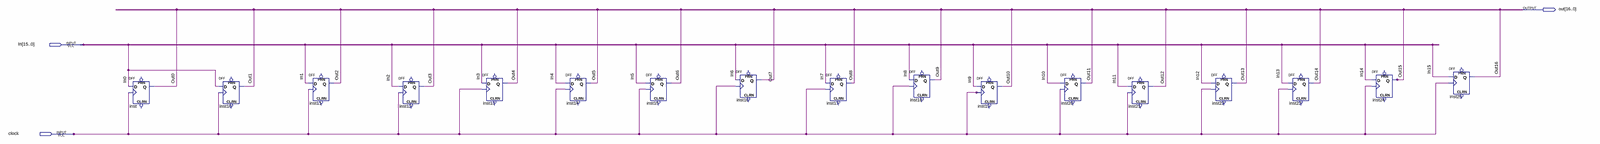
[diagram p0: schematic sheet, whole]
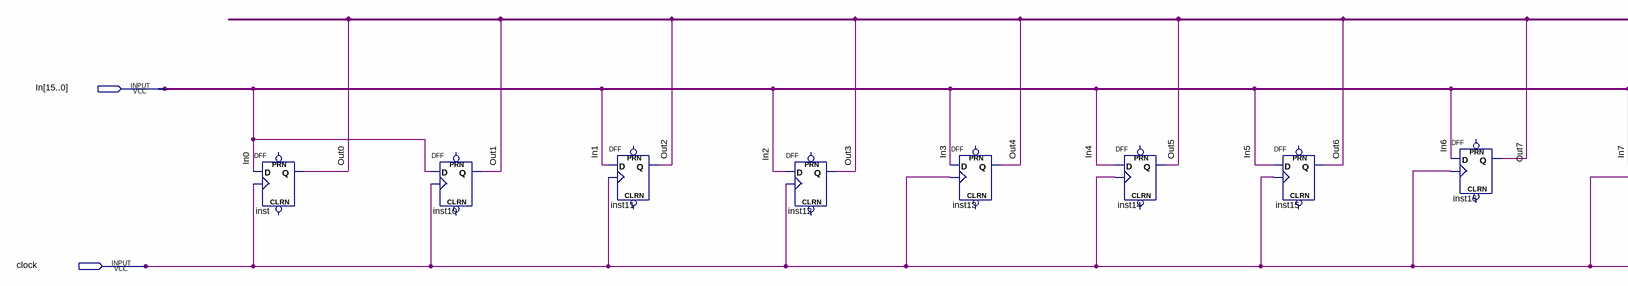
[diagram p1: schematic sheet, left part]
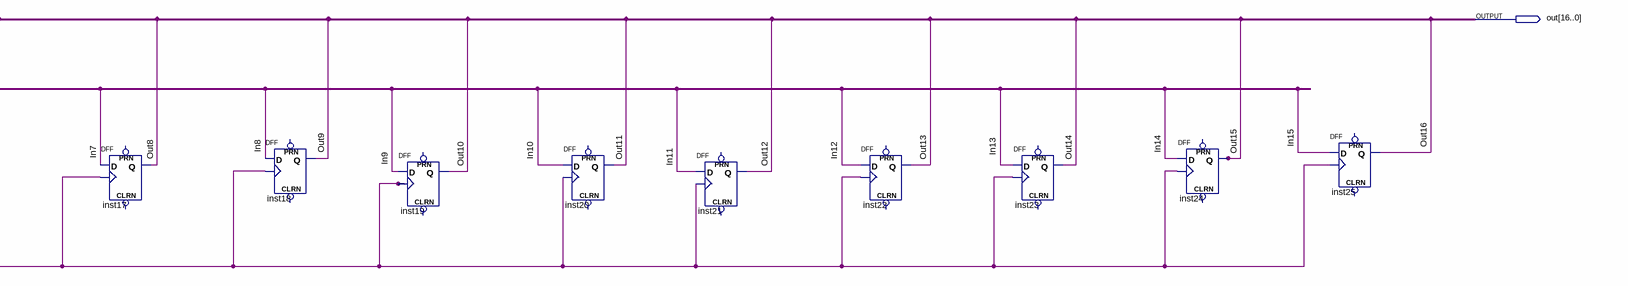
[diagram p2: schematic sheet, right part]
// Quartus schematic parallelshift.bdf as structural Verilog: 17 symbols, 3 pins
module parallelshift (
  input  [15:0] In,
  input  clock,
  output [16:0] out
);

  DFF inst (.CLK(clock), .D(In[0]), .Q(out[0]));  // open: CLRN, PRN
  DFF inst10 (.CLK(clock), .D(In[0]), .Q(out[1]));  // open: CLRN, PRN
  DFF inst11 (.CLK(clock), .D(In[1]), .Q(out[2]));  // open: CLRN, PRN
  DFF inst12 (.CLK(clock), .D(In[2]), .Q(out[3]));  // open: CLRN, PRN
  DFF inst13 (.CLK(clock), .D(In[3]), .Q(out[4]));  // open: CLRN, PRN
  DFF inst14 (.CLK(clock), .D(In[4]), .Q(out[5]));  // open: CLRN, PRN
  DFF inst15 (.CLK(clock), .D(In[5]), .Q(out[6]));  // open: CLRN, PRN
  DFF inst16 (.CLK(clock), .D(In[6]), .Q(out[7]));  // open: CLRN, PRN
  DFF inst17 (.CLK(clock), .D(In[7]), .Q(out[8]));  // open: CLRN, PRN
  DFF inst18 (.CLK(clock), .D(In[8]), .Q(out[9]));  // open: CLRN, PRN
  DFF inst19 (.CLK(clock), .D(In[9]), .Q(out[10]));  // open: CLRN, PRN
  DFF inst20 (.CLK(clock), .D(In[10]), .Q(out[11]));  // open: CLRN, PRN
  DFF inst21 (.CLK(clock), .D(In[11]), .Q(out[12]));  // open: CLRN, PRN
  DFF inst22 (.CLK(clock), .D(In[12]), .Q(out[13]));  // open: CLRN, PRN
  DFF inst23 (.CLK(clock), .D(In[13]), .Q(out[14]));  // open: CLRN, PRN
  DFF inst24 (.CLK(clock), .D(In[14]), .Q(out[15]));  // open: CLRN, PRN
  DFF inst25 (.CLK(clock), .D(In[15]), .Q(out[16]));  // open: CLRN, PRN
endmodule
